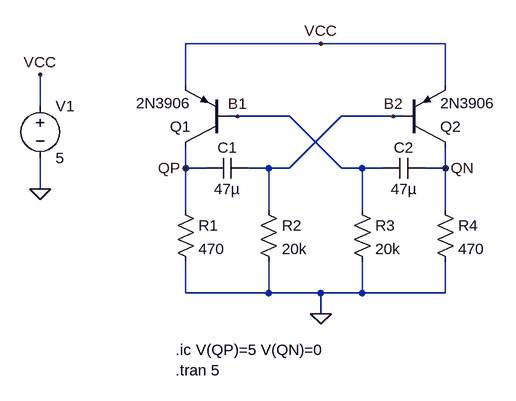
[diagram p0: schematic astable_pnp.asc]
astable_pnp.asc, the LTspice schematic file:
Version 4
SHEET 1 880 680
WIRE 240 48 32 48
WIRE 432 48 240 48
WIRE 32 112 32 48
WIRE 432 112 432 48
WIRE -192 144 -192 96
WIRE 112 160 96 160
WIRE 192 160 112 160
WIRE 352 160 272 160
WIRE 368 160 352 160
WIRE 32 240 32 208
WIRE 64 240 32 240
WIRE 160 240 128 240
WIRE 192 240 272 160
WIRE 192 240 160 240
WIRE 272 240 192 160
WIRE 304 240 272 240
WIRE 336 240 304 240
WIRE 432 240 432 208
WIRE 432 240 400 240
WIRE -192 272 -192 224
WIRE 32 304 32 240
WIRE 160 304 160 240
WIRE 304 304 304 240
WIRE 432 304 432 240
WIRE 32 432 32 384
WIRE 160 432 160 384
WIRE 160 432 32 432
WIRE 240 432 160 432
WIRE 304 432 304 384
WIRE 304 432 240 432
WIRE 432 432 432 384
WIRE 432 432 304 432
WIRE 240 464 240 432
FLAG 240 464 0
FLAG 240 48 VCC
FLAG 32 240 QP
FLAG 432 240 QN
FLAG -192 272 0
FLAG -192 96 VCC
FLAG 112 160 B1
FLAG 352 160 B2
SYMBOL res 16 288 R0
SYMATTR InstName R1
SYMATTR Value 470
SYMBOL res 144 288 R0
SYMATTR InstName R2
SYMATTR Value 20k
SYMBOL res 288 288 R0
SYMATTR InstName R3
SYMATTR Value 20k
SYMBOL res 416 288 R0
SYMATTR InstName R4
SYMATTR Value 470
SYMBOL cap 128 224 R90
WINDOW 0 0 32 VBottom 2
WINDOW 3 32 32 VTop 2
SYMATTR InstName C1
SYMATTR Value 47µ
SYMBOL cap 400 224 R90
WINDOW 0 0 32 VBottom 2
WINDOW 3 32 32 VTop 2
SYMATTR InstName C2
SYMATTR Value 47µ
SYMBOL voltage -192 128 R0
WINDOW 123 0 0 Left 0
WINDOW 39 0 0 Left 0
SYMATTR InstName V1
SYMATTR Value 5
SYMBOL pnp 96 208 R180
SYMATTR InstName Q1
SYMATTR Value 2N3906
SYMBOL pnp 368 208 M180
SYMATTR InstName Q2
SYMATTR Value 2N3906
TEXT 16 520 Left 2 !.ic V(QP)=5 V(QN)=0\n.tran 5

The netlist it stands for:
* astable_pnp.asc
R1 QP 0 470
R2 B2 0 20k
R3 B1 0 20k
R4 QN 0 470
C1 B2 QP 47µ
C2 QN B1 47µ
V1 VCC 0 5
Q1 QP B1 VCC 0 2N3906
Q2 QN B2 VCC 0 2N3906
.model NPN NPN
.model PNP PNP
.lib standard.bjt
.ic V(QP)=5 V(QN)=0
.tran 5
.backanno
.end